# EAGLE design dexv1 (EAGLE 9.6.2)
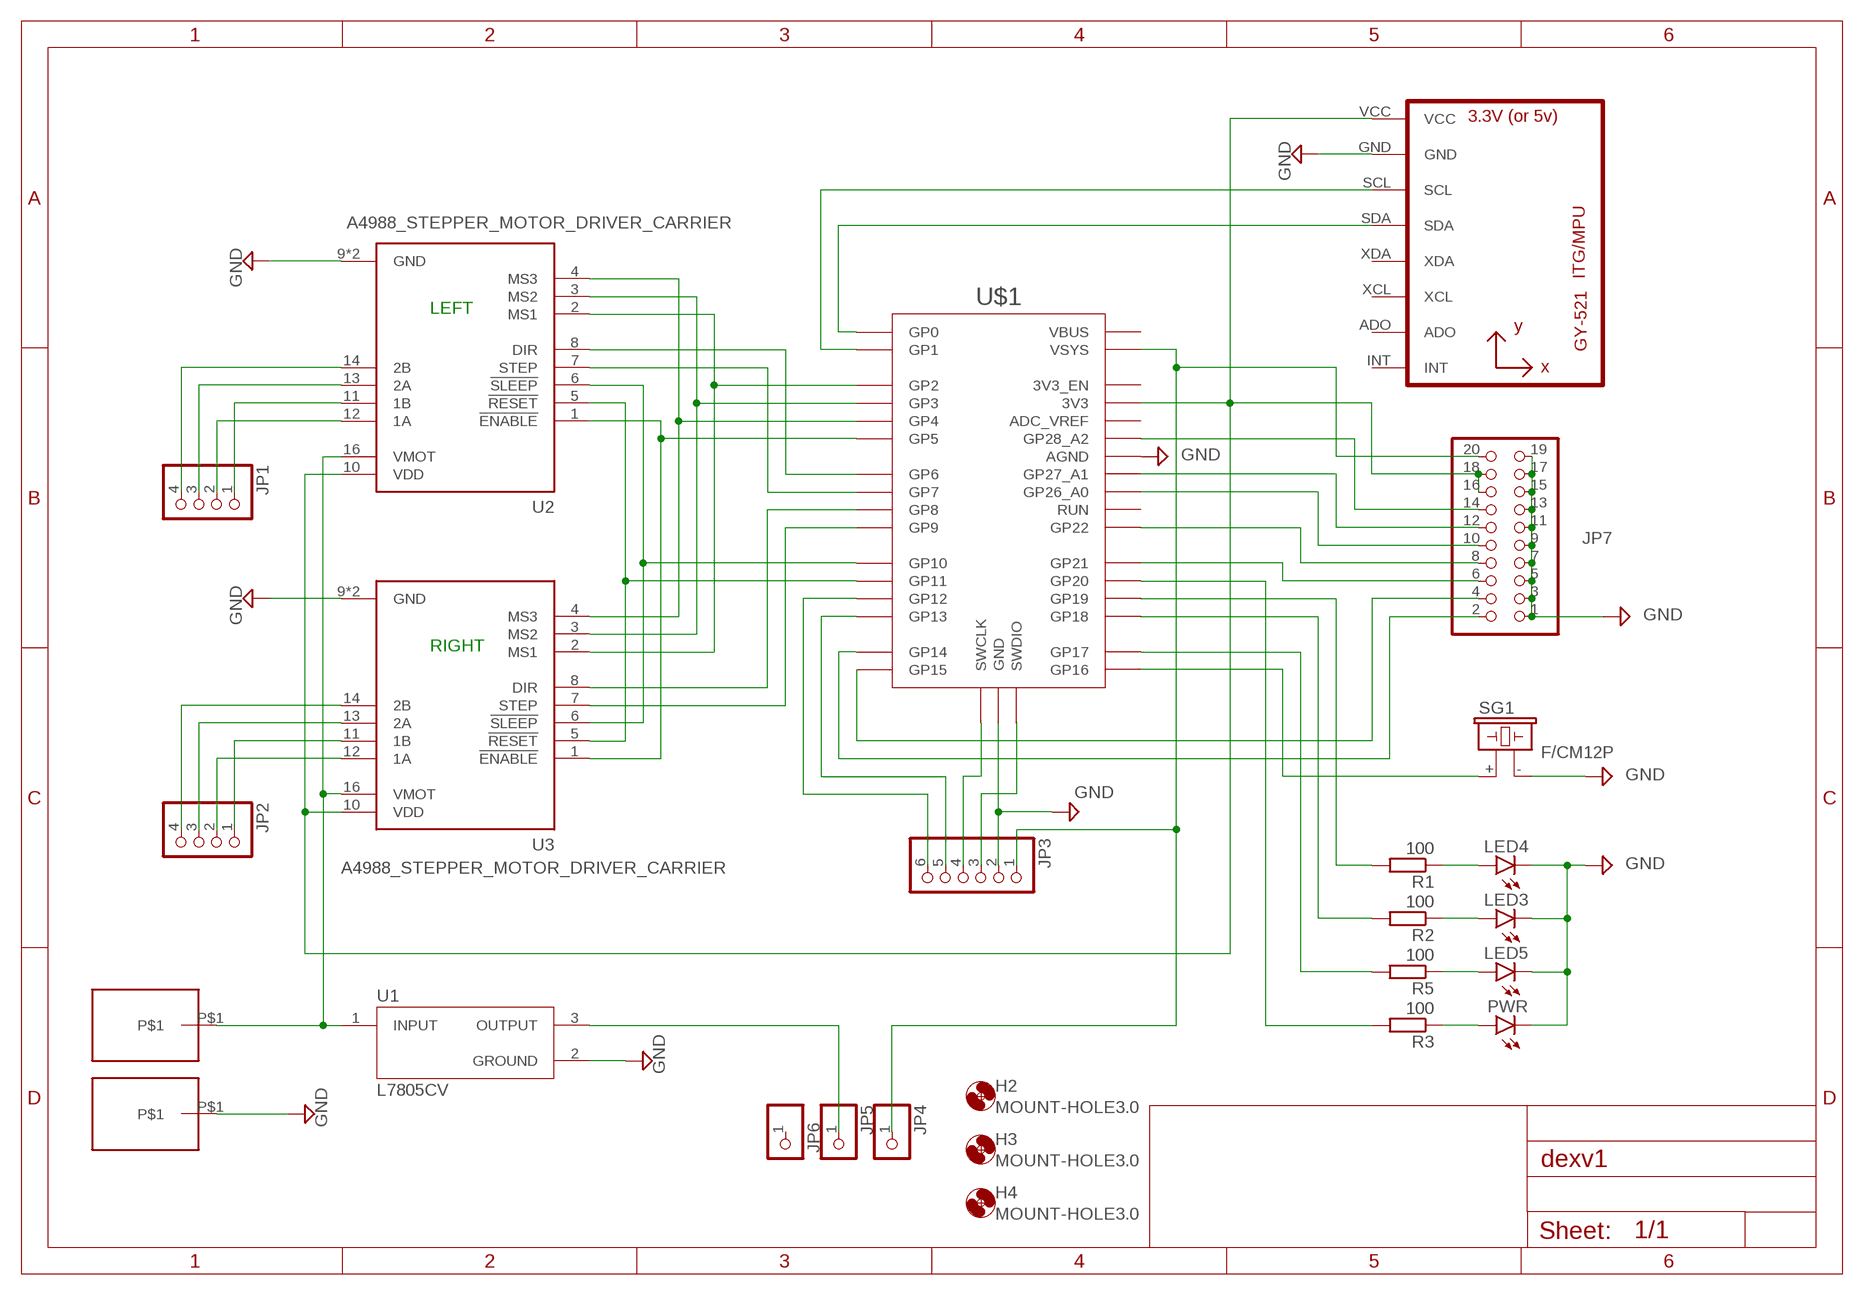
[diagram p0: schematic, sheet 1]

## Parts
H2  MOUNT-HOLE3.0  [3,0]
H3  MOUNT-HOLE3.0  [3,0]
H4  MOUNT-HOLE3.0  [3,0]
JP1  PINHD-1X4  [1X04]
JP2  PINHD-1X4  [1X04]
JP3  PINHD-1X6  [1X06]
JP4  PINHD-1X1  [1X01]
JP5  PINHD-1X1  [1X01]
JP6  PINHD-1X1  [1X01]
JP7  PINHD-2X10  [2X10]
LED3  LED5MM  [LED5MM]
LED4  LED5MM  [LED5MM]
LED5  LED5MM  [LED5MM]
PWR  LED5MM  [LED5MM]
R1  100  R-EU_0204/7  [0204/7]
R2  100  R-EU_0204/7  [0204/7]
R3  100  R-EU_0204/7  [0204/7]
R5  100  R-EU_0204/7  [0204/7]
SG1  F/CM12P  [F/CM12P]
U1  L7805CV  [TO255P1040X460X1968-3]
U2  A4988_STEPPER_MOTOR_DRIVER_CARRIER  [MODULE_A4988_STEPPER_MOTOR_DRIVER_CARRIER]
U3  A4988_STEPPER_MOTOR_DRIVER_CARRIER  [MODULE_A4988_STEPPER_MOTOR_DRIVER_CARRIER]
U4  GY-521MPU6050  [GY-521]
U$1  RPI_PICO-TH  [RPI_PICO_TH]
U$2  SMD5X10  [SMD5X10]
U$3  SMD5X10  [SMD5X10]

## Nets
GND: JP3.2 JP7.1 JP7.3 JP7.5 JP7.7 JP7.9 JP7.11 JP7.13 JP7.15 JP7.17 JP7.19 LED3.K(C) LED4.K(C) LED5.K(C) PWR.K(C) SG1.- U1.2(GROUND) U2.9(GND) U2.15(GND) U3.9(GND) U3.15(GND) U4.GND U$1.AGND U$1.GND@1(GND) U$1.GND@2(GND) U$1.GND@3(GND) U$1.GND@4(GND) U$1.GND@5(GND) U$1.GND@6(GND) U$1.GND@7(GND) U$1.GND@8(GND) U$1.P$2(GND) U$3.P$1
N$1: JP2.2 U3.12(1A)
N$2: U4.SDA U$1.GP0
N$3: JP7.14 U$1.GP28_A2
N$4: U2.4(MS3) U3.4(MS3) U$1.GP4
N$5: U2.3(MS2) U3.3(MS2) U$1.GP3
N$6: U2.2(MS1) U3.2(MS1) U$1.GP2
N$7: U2.8(DIR) U$1.GP6
N$8: U2.7(STEP) U$1.GP7
N$9: U3.8(DIR) U$1.GP8
N$10: U2.1(!ENABLE) U3.1(!ENABLE) U$1.GP5
N$11: U3.7(STEP) U$1.GP9
N$12: U2.6(!SLEEP) U3.6(!SLEEP) U$1.GP10
N$13: U2.5(!RESET) U3.5(!RESET) U$1.GP11
N$14: JP1.2 U2.12(1A)
N$15: JP1.1 U2.11(1B)
N$16: JP1.3 U2.13(2A)
N$17: JP1.4 U2.14(2B)
N$18: JP2.1 U3.11(1B)
N$19: JP2.3 U3.13(2A)
N$20: JP2.4 U3.14(2B)
N$21: JP3.1 JP4.1 JP7.20 U$1.VSYS
N$22: JP5.1 U1.3(OUTPUT)
N$23: JP7.4 U$1.GP15
N$24: SG1.+ U$1.GP16
N$25: U4.SCL U$1.GP1
N$26: LED4.A R1.1
N$27: LED3.A R2.1
N$28: R5.2 U$1.GP17
N$30: LED5.A R5.1
N$31: JP3.6 U$1.GP12
N$32: JP3.3 U$1.P$3(SWDIO) U$1.SWDIO
N$33: JP3.4 U$1.P$1(SWCLK) U$1.SWCLK
N$34: JP3.5 U$1.GP13
N$35: JP7.10 U$1.GP26_A0
N$36: R1.2 U$1.GP19
N$37: R2.2 U$1.GP18
N$38: JP7.12 U$1.GP27_A1
N$39: JP7.8 U$1.GP22
N$40: JP7.6 U$1.GP21
N$41: U1.1(INPUT) U2.16(VMOT) U3.16(VMOT) U$2.P$1
N$42: JP7.16 JP7.18 U2.10(VDD) U3.10(VDD) U4.VCC U$1.3V3
N$44: JP7.2 U$1.GP14
N$45: PWR.A R3.1
N$46: R3.2 U$1.GP20
Unconnected: JP6.1 U4.ADO U4.INT U4.XCL U4.XDA U$1.3V3_EN U$1.ADC_VREF U$1.RUN U$1.VBUS

## Notes on the sheet
- LEFT
- RIGHT

## Library data of the parts
H2-H4 = holes:MOUNT-HOLE: MOUNTING HOLE with drill center marker
JP1 JP2 = pinhead:PINHD-1X4: PIN HEADER
JP3 = pinhead:PINHD-1X6: PIN HEADER
JP4-JP6 = pinhead:PINHD-1X1: PIN HEADER
JP7 = pinhead:PINHD-2X10: PIN HEADER
LED3-LED5 PWR = led:LED: LED OSRAM: - CHIPLED LG R971, LG N971, LY N971, LG Q971, LY Q971, LO R971, LY R971 LH N974, LH R974 LS Q976, LO Q976, LY Q976 LO Q996 - Hyper CHIPLED LW Q18S LB Q993, LB Q99A, LB R99A - SideLED LS A670, LO A670, LY A670, LG A670, LP A670 LB A673, LV A673, LT A673, LW A673 LH A674 LY A675 LS A676, LA A676, LO A676, LY A676, LW A676 LS A679, LY A679, LG A679 - Hyper Micro SIDELED® LS Y876, LA Y876, LO Y876, LY Y876 LT Y87S - SmartLED LW L88C, LW L88S LB L89C, LB L89S, LG L890 LS L89K, LO L89K, LY L89K LS L896, LA L896, LO L896, LY L896 - TOPLED LS T670, LO T670, LY T670, LG T670, LP T670 LSG T670, LSP T670, LSY T670, LOP T670, LYG T670 LG T671, LOG T671, LSG T671 LB T673, LV T673, LT T673, LW T673 LH T674 LS T676, LA T676, LO T676, LY T676, LB T676, LH T676, LSB T676, LW T676 LB T67C, LV T67C, LT T67C, LS T67K, LO T67K, LY T67K, LW E67C LS E67B, LA E67B, LO E67B, LY E67B, LB E67C, LV E67C, LT E67C LW T67C LS T679, LY T679, LG T679 LS T770, LO T770, LY T770, LG T770, LP T770 LB T773, LV T773, LT T773, LW T773 LH T774 LS E675, LA E675, LY E675, LS T675 LS T776, LA T776, LO T776, LY T776, LB T776 LHGB T686 LT T68C, LB T68C - Hyper Mini TOPLED® LB M676 - Mini TOPLED Santana® LG M470 LS M47K, LO M47K, LY M47K Source: http://www.osram.convergy.de LUXEON: - LUMILED® LXK2-PW12-R00, LXK2-PW12-S00, LXK2-PW14-U00, LXK2-PW14-V00 LXK2-PM12-R00, LXK2-PM12-S00, LXK2-PM14-U00 LXK2-PE12-Q00, LXK2-PE12-R00, LXK2-PE12-S00, LXK2-PE14-T00, LXK2-PE14-U00 LXK2-PB12-K00, LXK2-PB12-L00, LXK2-PB12-M00, LXK2-PB14-N00, LXK2-PB14-P00, LXK2-PB14-Q00 LXK2-PR12-L00, LXK2-PR12-M00, LXK2-PR14-Q00, LXK2-PR14-R00 LXK2-PD12-Q00, LXK2-PD12-R00, LXK2-PD12-S00 LXK2-PH12-R00, LXK2-PH12-S00 LXK2-PL12-P00, LXK2-PL12-Q00, LXK2-PL12-R00 Source: www.luxeon.com KINGBRIGHT: KA-3528ASYC Source: www.kingbright.com
R1-R3 R5 = rcl:R-EU_: RESISTOR, European symbol; SPICEPREFIX: R
SG1 = buzzer:F/CM12P: BUZZER Source: Buerklin; OC_FARNELL: unknown; OC_NEWARK: unknown
U1 = L7805CV:L7805CV: Standard Regulator Pos 5V 1.5A 3-Pin(3+Tab) TO-220 Standard Regulator Pos 5V 1.5A 3-Pin(3+Tab) TO-220 Check availability <https://pricing.snapeda.com/parts/L7805C-V/STMicroelectronics/view-part?ref=eda>; AVAILABILITY: In Stock; CHECK_PRICES: https://www.snapeda.com/parts/L7805C-V/STMicroelectronics/view-part/?ref=eda; DESCRIPTION: Linear Voltage Regulator IC Positive Fixed 1 Output 1.5A TO-220; MF: STMicroelectronics; MP: L7805C-V; PACKAGE: TO-220-3 STMicroelectronics; PRICE: None; PURCHASE-URL: https://www.snapeda.com/api/url_track_click_mouser/?unipart_id=1064554&manufacturer=STMicroelectronics&part_name=L7805C-V&search_term=None; SNAPEDA_LINK: https://www.snapeda.com/parts/L7805C-V/STMicroelectronics/view-part/?ref=snap
U2 U3 = A4988_STEPPER_MOTOR_DRIVER_CARRIER:A4988_STEPPER_MOTOR_DRIVER_CARRIER: Stepper motor controler; IC: A4988; 1A; Uin mot: 8÷35V Check availability <https://pricing.snapeda.com/parts/A4988%20STEPPER%20MOTOR%20DRIVER%20CARRIER/Pololu/view-part?ref=eda>; AVAILABILITY: Not in stock; CHECK_PRICES: https://www.snapeda.com/parts/A4988%20STEPPER%20MOTOR%20DRIVER%20CARRIER/Pololu/view-part/?ref=eda; DESCRIPTION: Stepper Motor Driver; MF: Pololu; MP: A4988 STEPPER MOTOR DRIVER CARRIER; PACKAGE: None; PRICE: None; SNAPEDA_LINK: https://www.snapeda.com/parts/A4988%20STEPPER%20MOTOR%20DRIVER%20CARRIER/Pololu/view-part/?ref=snap
U4 = GY-521:GY-521: Check availability <https://pricing.snapeda.com/parts/GY-521/GODREAM%20FORDREAM%20CO.%2C%20LIMITED/view-part?ref=eda>; AVAILABILITY: Not in stock; CHECK_PRICES: https://www.snapeda.com/parts/GY-521/GODREAM+FORDREAM+CO.%252C+LIMITED/view-part/?ref=eda; DESCRIPTION: Triple Axis Accelerometer Gyro Breakout; MF: GODREAM FORDREAM CO., LIMITED; MP: GY-521; PACKAGE: Package; PRICE: None; SNAPEDA_LINK: https://www.snapeda.com/parts/GY-521/GODREAM+FORDREAM+CO.%252C+LIMITED/view-part/?ref=snap
U$1 = RaspberryPi_Pico:RPI_PICO
U$2 U$3 = wirepad:SMD5X10

## Board
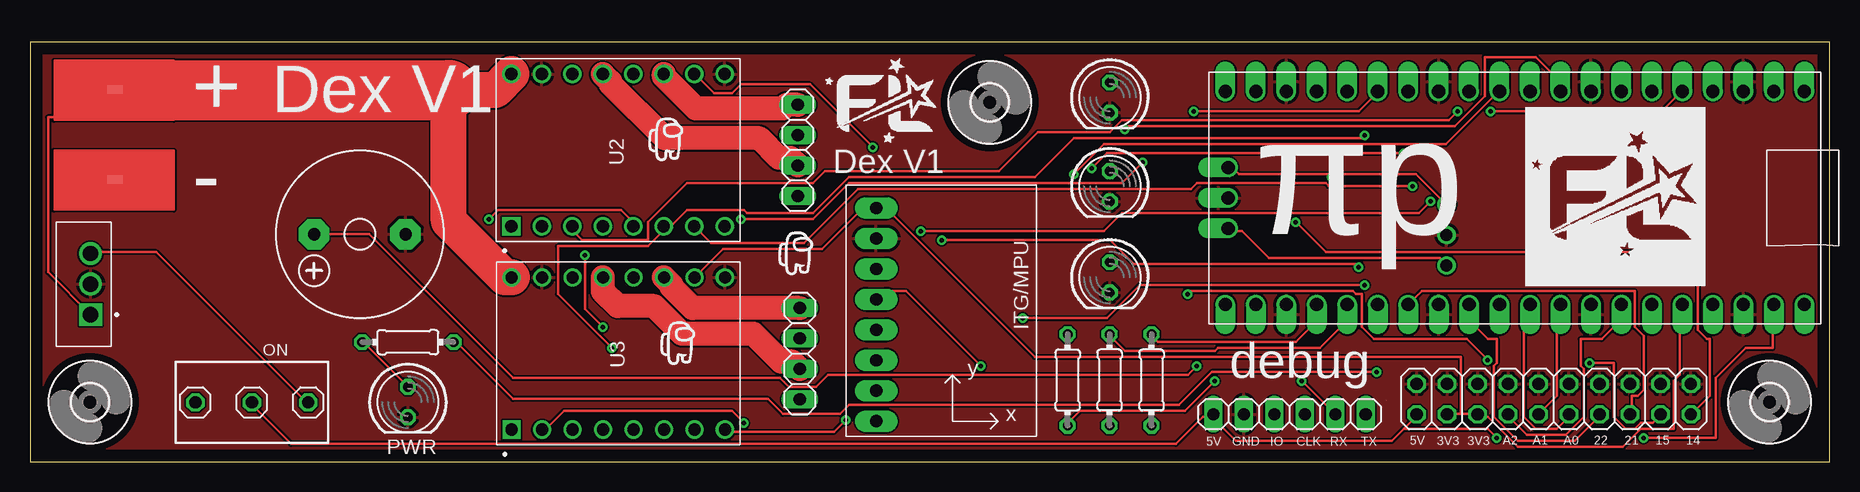
[diagram p1: board, top side]
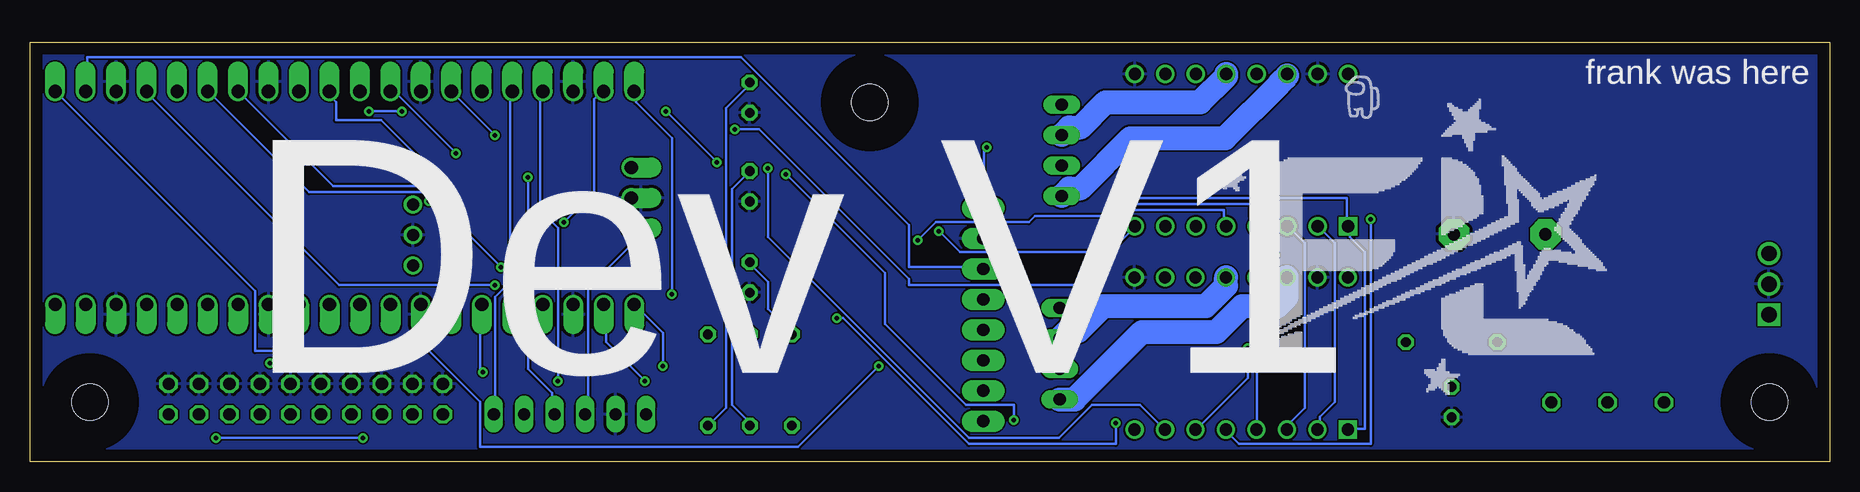
[diagram p2: board, bottom side, seen from below]

Size 150 x 35 mm. Coordinates in mm from the lower left corner, seen from the top.
Outline: 0,0 150,0 150,35 0,35 0,0
Copper layers (1*16): Top 0.035mm / dielectric 1.5mm / Bottom 0.035mm
Design rules "default *": minimum track width 0.2mm, minimum drill 0.35mm, track to track 6mil, track to pad 6mil, pad to pad 6mil, via to via 6mil, smd to smd 6mil, copper to edge 40mil, drill to drill 6mil, minimum pad ring 10mil, minimum via ring 8mil, stop-mask expansion 4mil, vias tented up to drill 0mil, thermal gap 10mil

### Footprints (pad centres in the part's own frame; a part is rotated, then mirrored left to right if it is on the bottom)
3,0 = hole 3: 0,0
1X04 = drill 1.016 long: 1 -3.81,0; 2 -1.27,0; 3 1.27,0; 4 3.81,0
1X06 = drill 1.016 long: 1 -6.35,0; 2 -3.81,0; 3 -1.27,0; 4 1.27,0; 5 3.81,0; 6 6.35,0
1X01 = drill 1.016 octagon: 1 0,0
2X10 = drill 1.016 octagon: 1 -11.43,-1.27; 2 -11.43,1.27; 3 -8.89,-1.27; 4 -8.89,1.27; 5 -6.35,-1.27; 6 -6.35,1.27; 7 -3.81,-1.27; 8 -3.81,1.27; 9 -1.27,-1.27; 10 -1.27,1.27; 11 1.27,-1.27; 12 1.27,1.27; 13 3.81,-1.27; 14 3.81,1.27; 15 6.35,-1.27; 16 6.35,1.27; 17 8.89,-1.27; 18 8.89,1.27; 19 11.43,-1.27; 20 11.43,1.27
LED5MM = drill 0.813 octagon: A -1.27,0; K 1.27,0
0204/7 = drill 0.813 octagon: 1 -3.81,0; 2 3.81,0
F/CM12P = drill 1.016 pad 2.54 octagon: + 3.81,0; - -3.81,0
TO255P1040X460X1968-3 = drill 1.27 pad 1.91 square: 1 0,0 | drill 1.27 pad 1.91: 2 2.55,0; 3 5.1,0
MODULE_A4988_STEPPER_MOTOR_DRIVER_CARRIER = drill 1.02 square: 1 -6.35,8.89 | drill 1.02: 2 -6.35,6.35; 3 -6.35,3.81; 4 -6.35,1.27; 5 -6.35,-1.27; 6 -6.35,-3.81; 7 -6.35,-6.35; 8 -6.35,-8.89; 9 6.35,-8.89; 10 6.35,-6.35; 11 6.35,-3.81; 12 6.35,-1.27; 13 6.35,1.27; 14 6.35,3.81; 15 6.35,6.35; 16 6.35,8.89
GY-521 = drill 1.016 pad 1.778 long: ADO -8.89,-6.35; GND -8.89,6.35; INT -8.89,-8.89; SCL -8.89,3.81; SDA -8.89,1.27; VCC -8.89,8.89; XCL -8.89,-3.81; XDA -8.89,-1.27
RPI_PICO_TH = drill 1.1 pad 1.6 offset: 3V3 19.391,39.467; 3V3_EN 19.391,42.007; ADC_VREF 19.391,36.927; AGND 19.391,31.847; GND@1 1.611,44.547; GND@2 1.611,31.847; GND@3 1.611,19.147; GND@4 1.611,6.447; GND@5 10.501,1.597; GND@6 19.391,6.447; GND@7 19.391,19.147; GND@8 19.391,44.547; GP0 1.611,49.627; GP1 1.611,47.087; GP2 1.611,42.007; GP3 1.611,39.467; GP4 1.611,36.927; GP5 1.611,34.387; GP6 1.611,29.307; GP7 1.611,26.767; GP8 1.611,24.227; GP9 1.611,21.687; GP10 1.611,16.607; GP11 1.611,14.067; GP12 1.611,11.527; GP13 1.611,8.987; GP14 1.611,3.907; GP15 1.611,1.367; GP16 19.391,1.367; GP17 19.391,3.907; GP18 19.391,8.987; GP19 19.391,11.527; GP20 19.391,14.067; GP21 19.391,16.607; GP22 19.391,21.687; GP26_A0 19.391,26.767; GP27_A1 19.391,29.307; GP28_A2 19.391,34.387; RUN 19.391,24.227; SWCLK 7.961,1.597; SWDIO 13.041,1.597; VBUS 19.391,49.627; VSYS 19.391,47.087 | drill 1: P$1 11.05,19.81; P$2 13.59,19.81; P$3 16.13,19.81
SMD5X10 = smd 1.27 x 0.635: P$1 5.08,2.54

### Placement (x,y rotation side)
H2  145,5 0 top
H3  80,30 0 top
H4  5,5 0 top
JP1  64,26 270 top
JP2  64.16,9.03 270 top
JP3  104.99,3.99 0 top
JP4  18.5,4.97 180 top
JP5  23.19,4.97 180 top
JP6  13.79,4.97 180 top
JP7  127.02,5.25 180 top
LED3  90.01,30.4 270 top
LED4  90.01,23 270 top
LED5  90.01,15.4 270 top
PWR  31.5,5 270 top
R1  89.99,6.84 90 top
R2  93.49,6.84 90 top
R3  31.5,10 0 top
R5  86.49,6.84 270 top
SG1  27.5,19 180 top
U1  5.04,12.29 90 top
U2  49.01,26.02 90 top
U3  49.04,9.05 90 top
U4  79.43,12.3 0 top
U$1  98.27,32.53 270 top
U$2  2,28.5 0 top
U$3  2,21 0 top

### Tracks (layer width: path | path; a pad name or v marks a point on that pad's centre or on a via)
GND
  pour Bottom: 0,35 0,0 150,0 150,35
  pour Top: 0,35 0,0 150,0 150,35
N$1
  Bottom 2: JP2.2 63.53,10.93 62.6,10.93 60.53,13 52,13 50.31,14.69 U3.12
N$2  (via drill 0.35)
  Top 0.2: v79.25,8 73,14.25 70.75,14.25 70.75,13.75 U4.SDA
  Bottom 0.2: v79.25,8 86,1.25 112.5,1.25 112.5,5 116.75,9.25 131.25,9.25 131.25,14.25 147.75,30.75 U$1.GP0
N$3
  Top 0.2: 132.5,11.75 132.5,13 U$1.GP28_A2 132.5,11.75 | 132.5,11.75 131,10.25 129.25,10.25 129.25,8 129.5,7.75 129.5,3.75 128,2.25 124.75,2.25 123.25,3.75 JP7.14
N$4  (via drill 0.35)
  Top 0.2: v47.75,11.25 46.25,12.75 v46.25,17.25 | v116.75,21.75 115.75,20.75 91,20.75 89.5,19.25 v74.25,19.25
  Bottom 0.2: v47.75,11.25 47.75,2.75 U3.4 | v46.25,17.25 47.5,18.5 47.5,19.5 U2.4 47.75,19.75 47.75,20 48.25,20.5 48.25,21.5 59,21.5 60.5,20 60.5,17.5 72.5,17.5 v74.25,19.25 | v116.75,21.75 116.75,22.5 126.75,22.5 135,30.75 U$1.GP4
N$5  (via drill 0.35)
  Top 0.2: v121.75,29.25 136,29.25 137.5,30.75 U$1.GP3 | v119,29.25 118.25,28.5 91,28.5 90,27.5 84,27.5 80.75,24.25 66.25,24.25 65.25,23.25 54.75,23.25 51.5,20 51.5,18.5 46,18.5 45,19.5 U2.3
  Bottom 0.2: U2.3 45,19.5 43.75,18.25 43.75,4.5 45,3.25 45,2.75 U3.3 | v119,29.25 v121.75,29.25
N$6  (via drill 0.35)
  Top 0.2: v111.25,14.75 92.5,14.75 89.75,12 v82.75,12 | v59.5,3.25 58.5,4.25 44.5,4.25 43,2.75 42.75,2.75 U3.2
  Bottom 0.2: U2.2 42.5,19.5 41.25,18.25 41.25,5 42.5,3.75 42.5,2.75 U3.2 | v111.25,14.75 124.25,14.75 140.25,30.75 U$1.GP2 | v82.75,12 82.25,12 71.75,1.5 59.5,1.5 v59.5,3.25
N$7  (via drill 0.35)
  Top 0.2: v91.25,27.75 91.5,28 118.75,28 121.25,30.5 121.25,33.75 125.5,33.75 127.5,31.75 127.5,31 U$1.GP6
  Bottom 0.2: v91.25,27.75 89.25,27.75 76.75,15.25 76.75,14.75 62.75,14.75 58,19.5 U2.8
N$8  (via drill 0.35)
  Top 0.2: v115.25,23 108.25,23 108,23.25 97.25,23.25 96.75,22.75 69,22.75 64.5,18.25 56.75,18.25 55.5,19.5 U2.7
  Bottom 0.2: v115.25,23 120.75,28.5 124.5,28.5 124.5,30 125,30.5 125,30.75 U$1.GP7
N$9  (via drill 0.35)
  Top 0.2: v68,3.5 67,2.5 58,2.5 U3.8 | v87,24 89.5,26.5 118,26.5 122.25,30.75 U$1.GP8
  Bottom 0.2: v68,3.5 68,4.75 72,4.75 78.75,11.5 78.75,15.75 v87,24
N$10  (via drill 0.35)
  Top 0.2: v110.75,16.25 110.5,16.5 92,16.5 90,18.5 v76,18.5
  Bottom 0.2: U3.1 40,2.75 38.75,2.75 38.75,17.5 40,18.75 40,19.5 U2.1 40.25,19.75 40.25,22 59,22 60.5,20.5 66.25,20.5 66.75,20 74.5,20 v76,18.5 | v110.75,16.25 116,21.5 116,23 124.75,23 132.5,30.75 U$1.GP5
N$11  (via drill 0.35)
  Top 0.2: v88.5,24.5 89.75,25.75 v114.5,25.75
  Bottom 0.2: v88.5,24.5 88.5,18.75 71.75,2 64.25,2 61.5,4.75 57.5,4.75 55.5,2.75 U3.7 | v114.5,25.75 119.75,31 U$1.GP9
N$12  (via drill 0.35)
  Top 0.2: v48.5,9.5 44,14 44,18 51.5,18 53,19.5 U2.6 53,19.75 53.5,19.75 54.75,21 59.5,21 59.75,20.75 65.25,20.75 68.25,23.75 83.75,23.75 87,27 111,27 v111.25,27.25
  Bottom 0.2: v48.5,9.5 48.5,7 52.75,2.75 U3.6 | v111.25,27.25 114.75,30.75 U$1.GP10
N$13  (via drill 0.35)
  Top 0.2: v38.25,20.25 39,21 49.25,21 50.5,19.75 U2.5 | v97,29.25 110.75,29.25 112.25,30.75 U$1.GP11 | v92.75,25 91,23.25 68.25,23.25 65.25,20.25 v59.25,20.25
  Bottom 0.2: v38.25,20.25 38.25,1.5 49.25,1.5 50.25,2.5 U3.5 | v92.75,25 v97,29.25 | v59.25,20.25 58.5,21 50.5,21 50.5,19.75 U2.5
N$14
  Bottom 2: JP1.2 63.37,27.9 62.45,27.9 60.34,30 52.48,30 50.28,32.19 U2.12
N$15
  Top 2: JP1.1 63.08,29.81 62.77,29.5 55.5,29.5 52.82,32.18 U2.11
N$16
  Top 2: JP1.3 63.37,25.36 62.45,25.36 60.8,27 52.94,27 48.37,31.57 48.37,31.74 U2.13
N$17
  Bottom 0.2: U2.14 45.25,32.5 45.2,32.25
  Bottom 2: JP1.4 63.37,22.82 62.45,22.82 58.26,27 50.4,27 45.83,31.57 45.83,31.62 45.2,32.25
N$18
  Top 2: U3.11 53.47,14.78 53.47,14.61 55.24,12.84 JP2.1
N$19
  Top 2: JP2.3 63.53,8.39 62.6,8.39 60.3,10.69 54.35,10.69 52.03,13 49,13 47.77,14.23 U3.13
N$20
  Bottom 2: JP2.4 62.93,5.22 57.3,10.85 51.11,10.85 48.96,13 46,13 45.23,13.77 U3.14
N$21  (via drill 0.35)
  Top 0.2: 98.5,3.75 97.75,3.75 95.5,1.5 21.75,1.5 18.5,4.75 JP4.1 | 98.5,3.75 100.5,1.75 113.5,1.75 114.5,2.75 | U$1.VSYS 145.25,13 145.25,9.5 143,9.5 140.5,7 140.5,2 v134.5,2 | 98.5,3.75 JP3.1 | 114.5,2.75 115.5,3.75 JP7.20 | v122.25,2 121.5,2.75 114.5,2.75
  Bottom 0.2: v122.25,2 v134.5,2
N$22
  Top 0.2: U1.3 5.16,17.5 10.5,17.5 23,5 JP5.1
N$23  (via drill 0.35)
  Top 0.2: v130,8.25 132,8.25 132,3.75 133,2.75 133.75,2.75 134.25,3.25 135.25,3.25 135.75,3.75 JP7.4 | v121.5,8.5 119.75,10.25 112,10.25 111,11.25 111,14 110.5,14 110.25,14.25 96.75,14.25 v96.5,14
  Bottom 0.2: v96.5,14 96.5,27 99.5,30 99.5,30.75 U$1.GP15 | v130,8.25 129.75,8.5 v121.5,8.5
N$24  (via drill 0.35)
  Top 0.2: v97.25,8 96.5,7.25 66.5,7.25 65.5,6.25 63.25,6.25 62.5,7 40.25,7 28.25,19 23.75,19 SG1.+
  Bottom 0.2: v97.25,8 97.25,10.75 99.5,13 U$1.GP16
N$25
  Bottom 0.2: U$1.GP1 145.25,31 145.25,33.75 90.75,33.75 76.75,19.75 76.75,16.25 70.75,16.25 U4.SCL
N$26
  Bottom 0.2: R1.1 90,3.25 91.5,4.75 91.5,22.75 90.25,24 90.25,24.25 LED4.A
N$27
  Bottom 0.2: R2.1 93.25,3.25 92,4.5 92,29.5 90.25,31.25 90.25,31.5 LED3.A
N$28  (via drill 0.35)
  Top 0.2: v98.75,6.75 96.25,4.25 87.5,4.25 86.5,3.25 R5.2
  Bottom 0.2: v98.75,6.75 102,10 102,13 U$1.GP17
N$30
  Bottom 0.2: R5.1 86.5,10.75 88.5,12.75 88.5,15 90,16.5 LED5.A
N$31
  Bottom 0.2: JP3.6 111.25,4 111.25,13.75 110,15 110,30.75 U$1.GP12
N$32
  Top 0.2: U$1.P$3 118,16.5 117.5,17 103.25,17 101,19.25 100,19.25 U$1.SWDIO
  Bottom 0.2: JP3.3 103.5,4 103.5,14.5 99.75,18.25 99.75,19.25 U$1.SWDIO
N$33  (via drill 0.35)
  Top 0.2: 108.5,24 100.75,24 100.25,24.5 100,24.5 U$1.SWCLK | 108.5,24 115.5,24 118,21.5 U$1.P$1 | 108.5,24 v108.5,23.75
  Bottom 0.2: v108.5,23.75 108.5,7.75 106.5,5.75 106.5,4 JP3.4
N$34  (via drill 0.35)
  Top 0.2: v106,6.75 108.75,4 JP3.5
  Bottom 0.2: v106,6.75 106,19.5 107.5,21 107.5,30.75 U$1.GP13
N$35
  Top 0.2: JP7.10 128.25,3.75 127.25,2.75 125.5,2.75 124.5,3.75 124.5,13 125,13 U$1.GP26_A0
N$36
  Top 0.2: R1.2 90,10.5 91.25,9.25 98.75,9.25 99,9.5 107.5,9.5 109.75,11.75 109.75,13 U$1.GP19
N$37
  Top 0.2: R2.2 93.5,10.5 94,10 105.5,10 107.25,11.75 107.25,13 U$1.GP18
N$38
  Top 0.2: JP7.12 125.75,4 127.25,5.5 127.25,13 127.5,13 U$1.GP27_A1
N$39
  Top 0.2: 120,11.75 120,13 U$1.GP22 120,11.75 | 120,11.75 121.5,10.25 122.25,10.25 122.25,8.25 122,8 122,3.75 124,1.75 128.75,1.75 130.75,3.75 JP7.8
N$40
  Top 0.2: JP7.6 133.5,4 133.5,5.5 134,5.5 134.5,6 134.5,10.5 133.75,11.25 133.75,14.25 116,14.25 115,13.25 U$1.GP21
N$41
  Top 0.2: U1.1 1.5,15.84 1.5,28.75 6.25,28.75 U$2.P$1
  Top 3: U3.16 39.6,15.4 34.9,20.1 34.9,31.04 38.8,31.04 U2.16
  Top 5: U$2.P$1 34.9,31.04
N$42  (via drill 0.35)
  Top 0.2: v70.25,26.25 65,31.5 59.25,31.5 58.5,30.75 57,30.75 55.5,32.25 U2.10 | U3.10 55.5,15.5 57.75,17.75 66,17.75 69.25,21 70.5,21 U4.VCC 70.75,21 71.5,21 83.75,8.75 98.75,8.75 119.25,8.75 119.25,4 | 119.25,4 120.5,4 JP7.16 120.75,3.75 121.5,3.75 124,1.25 132.75,1.25 134.25,2.75 137,2.75 137,6.75 137.5,7.25 137.5,13 U$1.3V3 | 119.25,4 118.25,4 JP7.18
  Bottom 0.2: v70.25,26.25 70.5,26 70.5,21.25 U4.VCC
N$44  (via drill 0.35)
  Top 0.2: v105.5,20 108,17.5 139,17.5 139,11 139.75,10.25 140,10.25 140,5.5 138.5,4 JP7.2
  Bottom 0.2: v105.5,20 103,22.5 103,30.25 102.25,31 U$1.GP14
N$45
  Top 0.2: R3.1 27.75,10 31.25,6.5 31.5,6.5 PWR.A
N$46  (via drill 0.35)
  Top 0.2: v112.25,7.5 98.5,7.5 95.75,4.75 68.25,4.75 67.5,4 62.75,4 61.5,5.25 40.25,5.25 35.5,10 R3.2
  Bottom 0.2: v112.25,7.5 112.5,7.75 112.5,13 U$1.GP20

### Text on the board
tPlace: + | Dex V1 | Dex V1 | - | πp | ON | debug | * | 5V | GND | IO | CLK | RX | TX | 5V | 3V3 | 3V3 | A2 | A1 | A0 | 22 | 21 | 15 | 14
bPlace: frank was here | Dev V1